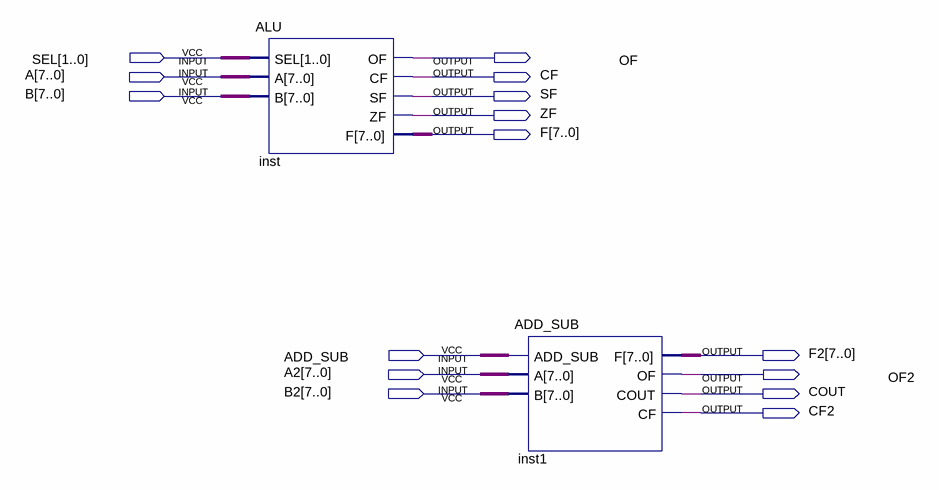
[diagram p0: schematic sheet]
// Quartus schematic CO.bdf as structural Verilog: 2 symbols, 15 pins
module CO (
  input  [1:0] SEL,
  input  [7:0] A,
  input  [7:0] B,
  input  ADD_SUB,
  input  [7:0] A2,
  input  [7:0] B2,
  output OF,
  output CF,
  output SF,
  output ZF,
  output [7:0] F,
  output [7:0] F2,
  output OF2,
  output COUT,
  output CF2
);

  ALU inst (.SEL(SEL), .A(A), .B(B), .OF(OF), .CF(CF), .SF(SF), .ZF(ZF), .F(F));
  ADD_SUB inst1 (.ADD_SUB(ADD_SUB), .A(A2), .B(B2), .F(F2), .OF(OF2), .COUT(COUT), .CF(CF2));
endmodule
